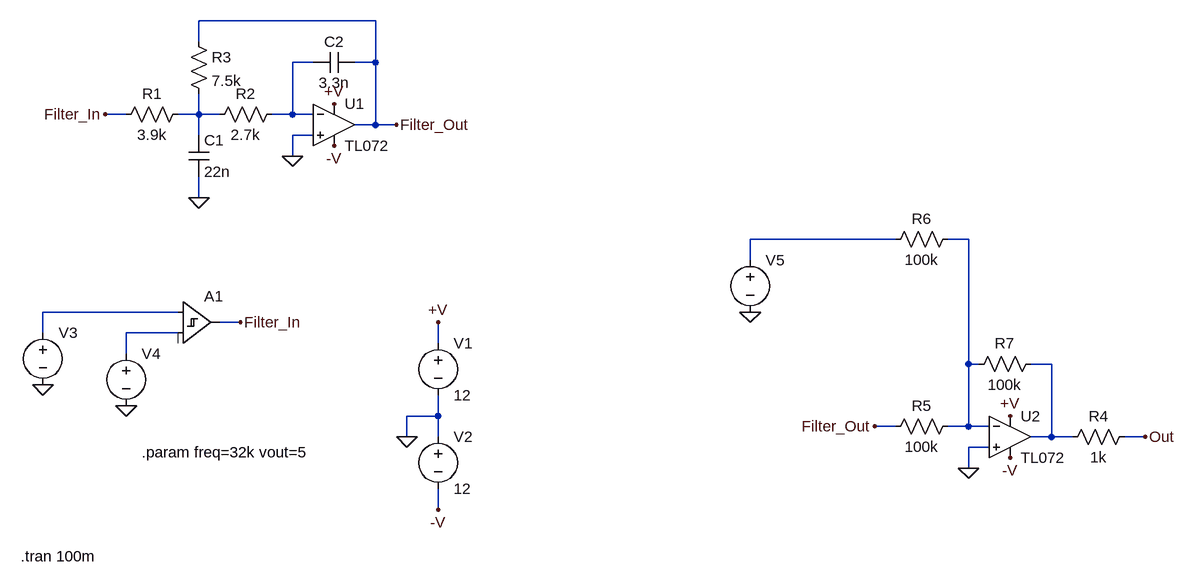
[diagram p0: schematic Arduino VCO Output Stage.asc]
Arduino VCO Output Stage.asc, the LTspice schematic file:
Version 4
SHEET 1 1052 680
WIRE -192 -432 -464 -432
WIRE -464 -400 -464 -432
WIRE -288 -368 -320 -368
WIRE -192 -368 -192 -432
WIRE -192 -368 -224 -368
WIRE -576 -288 -608 -288
WIRE -464 -288 -464 -320
WIRE -464 -288 -496 -288
WIRE -432 -288 -464 -288
WIRE -320 -288 -320 -368
WIRE -320 -288 -352 -288
WIRE -288 -288 -320 -288
WIRE -192 -272 -192 -368
WIRE -192 -272 -224 -272
WIRE -160 -272 -192 -272
WIRE -464 -256 -464 -288
WIRE -288 -256 -320 -256
WIRE -320 -224 -320 -256
WIRE -464 -160 -464 -192
WIRE 608 -96 384 -96
WIRE 720 -96 688 -96
WIRE 384 -64 384 -96
WIRE -496 16 -704 16
WIRE -400 32 -432 32
WIRE -704 48 -704 16
WIRE -496 48 -576 48
WIRE -96 64 -96 32
WIRE -576 80 -576 48
WIRE 720 96 720 -96
WIRE 736 96 720 96
WIRE 848 96 816 96
WIRE -96 176 -96 144
WIRE -96 176 -144 176
WIRE 608 192 576 192
WIRE 720 192 720 96
WIRE 720 192 688 192
WIRE 752 192 720 192
WIRE -144 208 -144 176
WIRE -96 208 -96 176
WIRE 848 208 848 96
WIRE 848 208 816 208
WIRE 880 208 848 208
WIRE 992 208 960 208
WIRE 752 224 720 224
WIRE 720 256 720 224
WIRE -96 320 -96 288
FLAG -96 320 -V
FLAG -96 32 +V
FLAG -144 208 0
FLAG -608 -288 Filter_In
FLAG -464 -160 0
FLAG -256 -304 +V
FLAG -256 -240 -V
FLAG -320 -224 0
FLAG 992 208 Out
FLAG -704 128 0
FLAG -576 160 0
FLAG -400 32 Filter_In
FLAG 384 16 0
FLAG 784 176 +V
FLAG 784 240 -V
FLAG 720 256 0
FLAG -160 -272 Filter_Out
FLAG 576 192 Filter_Out
SYMBOL voltage -96 48 R0
SYMATTR InstName V1
SYMATTR Value 12
SYMBOL voltage -96 192 R0
SYMATTR InstName V2
SYMATTR Value 12
SYMBOL res -480 -304 R90
WINDOW 0 0 56 VBottom 2
WINDOW 3 32 56 VTop 2
SYMATTR InstName R1
SYMATTR Value 3.9k
SYMBOL cap -480 -256 R0
SYMATTR InstName C1
SYMATTR Value 22n
SYMBOL Own\ Elements\\OpAmps\\TL072 -256 -336 R0
SYMATTR InstName U1
SYMBOL res 976 192 R90
WINDOW 0 0 56 VBottom 2
WINDOW 3 32 56 VTop 2
SYMATTR InstName R4
SYMATTR Value 1k
SYMBOL voltage -704 32 R0
WINDOW 3 24 96 Invisible 2
WINDOW 123 0 0 Left 0
WINDOW 39 0 0 Left 0
SYMATTR InstName V3
SYMATTR Value SINE(0.5 0.5 1k)
SYMBOL Digital\\diffschmtbuf -496 -32 R0
SYMATTR InstName A1
SYMATTR SpiceLine ref=0 vlow=0 vhigh={vout} td=10p trise=1p tfall=1p
SYMBOL voltage -576 64 R0
WINDOW 3 24 96 Invisible 2
WINDOW 123 0 0 Left 0
WINDOW 39 0 0 Left 0
SYMATTR InstName V4
SYMATTR Value PULSE(0 1 0 {0.5/freq} {0.5/freq} 1p {1/freq})
SYMBOL res -336 -304 R90
WINDOW 0 0 56 VBottom 2
WINDOW 3 32 56 VTop 2
SYMATTR InstName R2
SYMATTR Value 2.7k
SYMBOL voltage 384 -80 R0
WINDOW 3 24 96 Invisible 2
WINDOW 123 0 0 Left 0
WINDOW 39 0 0 Left 0
SYMATTR InstName V5
SYMATTR Value 5
SYMBOL Own\ Elements\\OpAmps\\TL072 784 144 R0
SYMATTR InstName U2
SYMBOL res 704 176 R90
WINDOW 0 0 56 VBottom 2
WINDOW 3 32 56 VTop 2
SYMATTR InstName R5
SYMATTR Value 100k
SYMBOL res 704 -112 R90
WINDOW 0 0 56 VBottom 2
WINDOW 3 32 56 VTop 2
SYMATTR InstName R6
SYMATTR Value 100k
SYMBOL res 832 80 R90
WINDOW 0 0 56 VBottom 2
WINDOW 3 32 56 VTop 2
SYMATTR InstName R7
SYMATTR Value 100k
SYMBOL res -480 -416 R0
SYMATTR InstName R3
SYMATTR Value 7.5k
SYMBOL cap -224 -384 R90
WINDOW 0 0 32 VBottom 2
WINDOW 3 32 32 VTop 2
SYMATTR InstName C2
SYMATTR Value 3.3n
TEXT -552 232 Left 2 !.param freq=32k vout=5
TEXT -738 392 Left 2 !.tran 100m

The netlist it stands for:
* Arduino VCO Output Stage.asc
V1 +V 0 12
V2 0 -V 12
R1 N002 Filter_In 3.9k
C1 N002 0 22n
* U1: TL072 (symbol Own Elements\OpAmps\TL072 not available, pins judged from their places): In+=0 In-=N001 V+=+V V-=-V OUT=Filter_Out
R4 Out N007 1k
V3 N005 0 SINE(0.5 0.5 1k)
A1 N005 N006 0 0 0 0 Filter_In 0 SCHMITT ref=0 vlow=0 vhigh={vout} td=10p trise=1p tfall=1p
V4 N006 0 PULSE(0 1 0 {0.5/freq} {0.5/freq} 1p {1/freq})
R2 N001 N002 2.7k
V5 N003 0 5
* U2: TL072 (symbol Own Elements\OpAmps\TL072 not available, pins judged from their places): In+=0 In-=N004 V+=+V V-=-V OUT=N007
R5 N004 Filter_Out 100k
R6 N004 N003 100k
R7 N007 N004 100k
R3 Filter_Out N002 7.5k
C2 Filter_Out N001 3.3n
.param freq=32k vout=5
.tran 100m
.backanno
.end